# EAGLE design Crystal Cmoy Sch EaglePCB 1 (EAGLE 6.2)
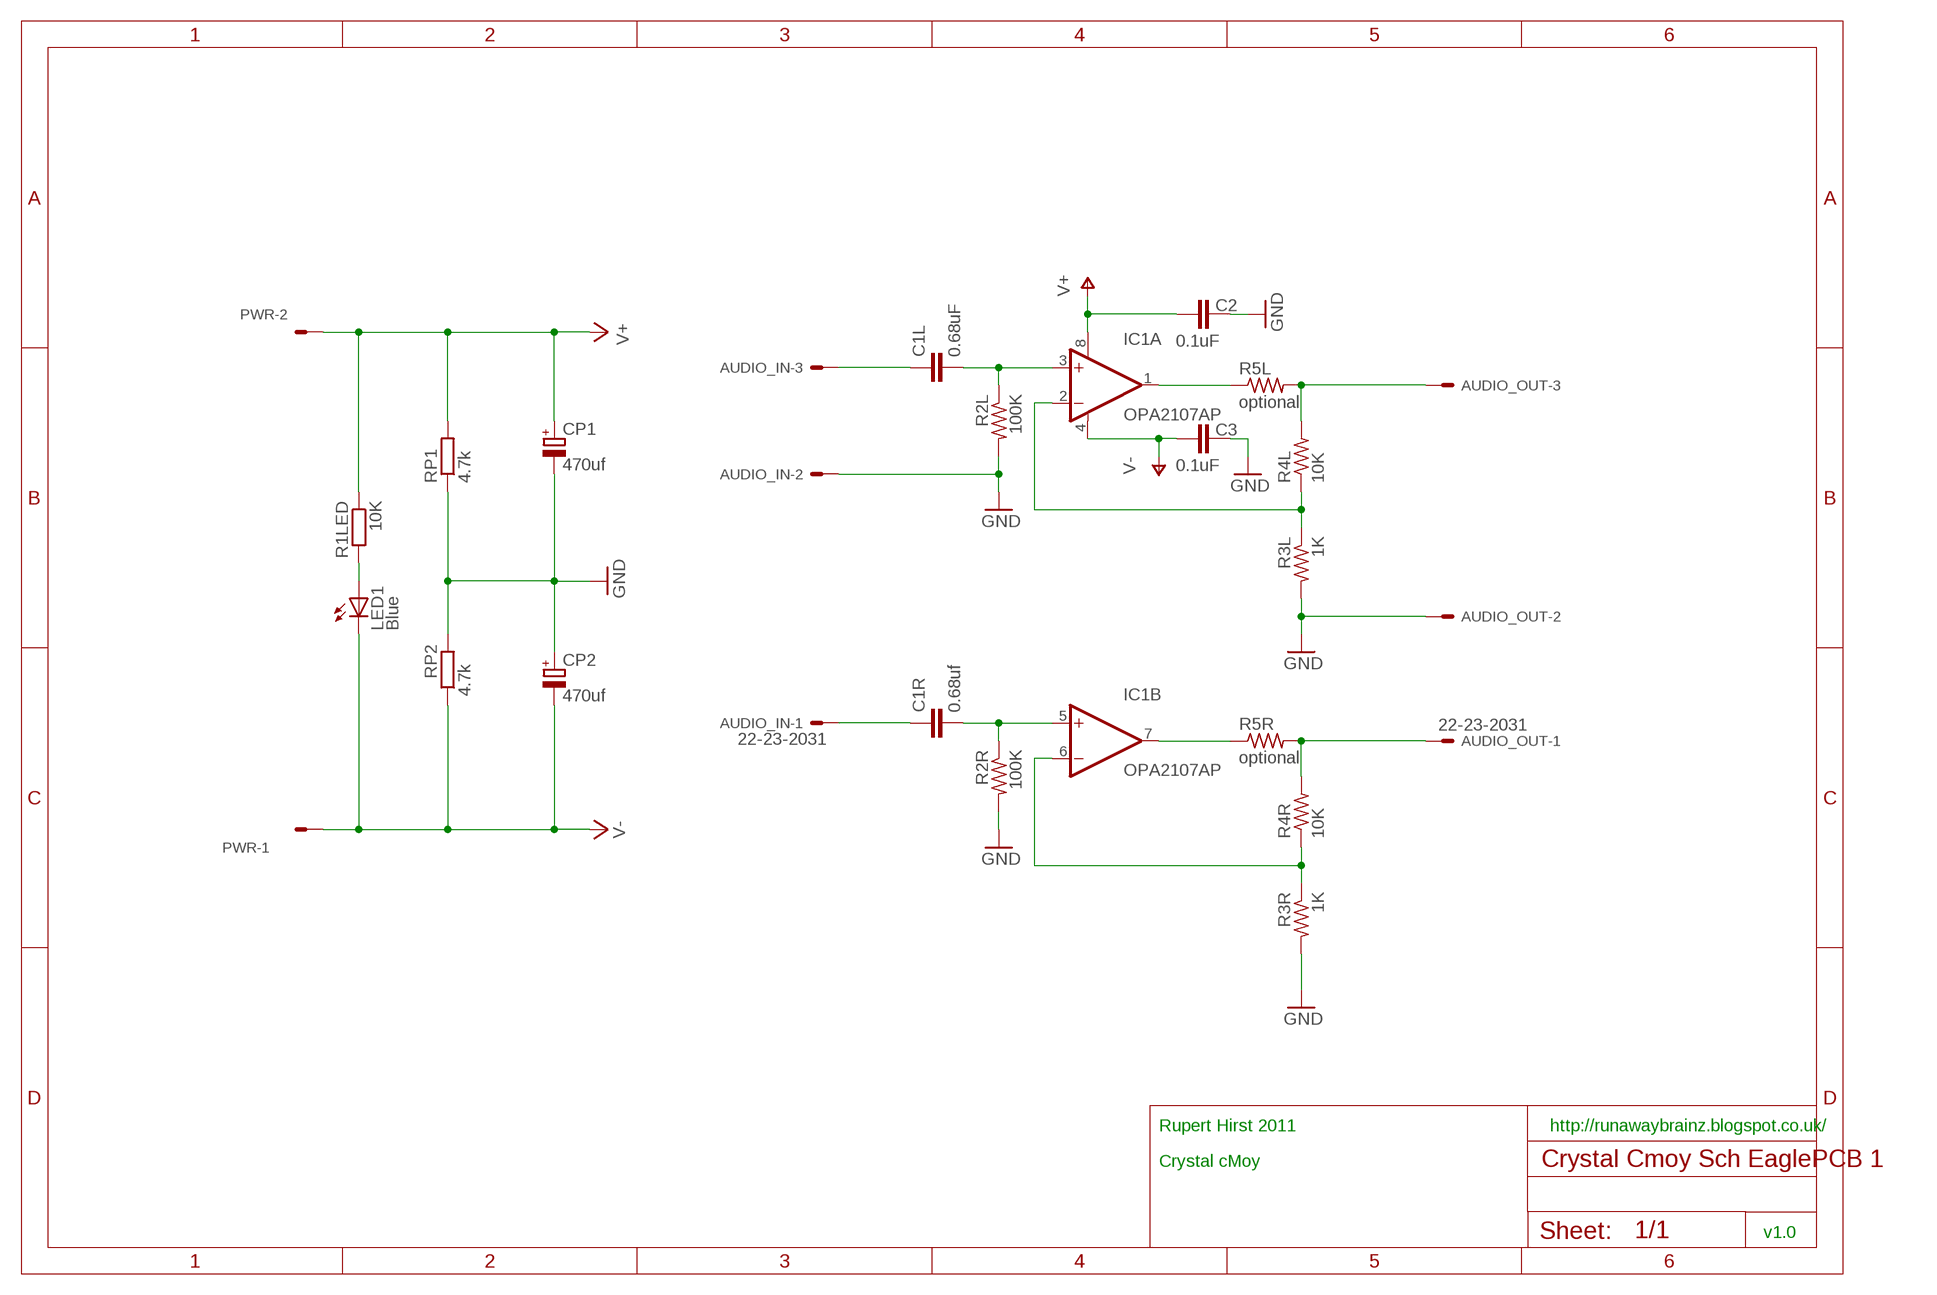
[diagram p0: schematic, sheet 1]

## Parts
AUDIO_IN  22-23-2031  [22-23-2031]
AUDIO_OUT  22-23-2031  [22-23-2031]
C1L  0.68uF  C15/7  [C15B7]
C1R  0.68uf  C15/7  [C15B7]
C2  0.1uF  C5/2.5  [C5B2.5]
C3  0.1uF  C5/5.5  [C5B5.5]
CP1  470uf  CPOL-EUE5-13  [E5-13]
CP2  470uf  CPOL-EUE5-13  [E5-13]
IC1  OPA2107AP  OPA2132P  [DIL08]
LED1  Blue  LED3MM  [LED3MM]
PWR  22-23-2021  [22-23-2021]
R1LED  10K  R-EU_0207/2V  [0207/2V]
R2L  100K  R-US_0207/10  [0207/10]
R2R  100K  R-US_0207/10  [0207/10]
R3L  1K  R-US_0207/10  [0207/10]
R3R  1K  R-US_0207/10  [0207/10]
R4L  10K  R-US_0207/10  [0207/10]
R4R  10K  R-US_0207/10  [0207/10]
R5L  optional  R-US_0207/10  [0207/10]
R5R  optional  R-US_0207/10  [0207/10]
RP1  4.7k  R-EU_0207/10  [0207/10]
RP2  4.7k  R-EU_0207/10  [0207/10]

## Nets
GND: AUDIO_IN.2 AUDIO_OUT.2 C2.1 C3.2 CP1.- CP2.+ R2L.2 R2R.2 R3L.2 R3R.2 RP1.1 RP2.2
L-IN: AUDIO_IN.3 C1L.1
L-OUT: AUDIO_OUT.3 R4L.2 R5L.2
N$1: IC1.1(A:OUT) R5L.1
N$3: IC1.2(A:-IN) R3L.1 R4L.1
N$4: C1L.2 IC1.3(A:+IN) R2L.1
N$5: IC1.7(B:OUT) R5R.1
N$7: IC1.6(B:-IN) R3R.1 R4R.1
N$8: C1R.2 IC1.5(B:+IN) R2R.1
N$14: LED1.A R1LED.2
R-IN: AUDIO_IN.1 C1R.1
R-OUT: AUDIO_OUT.1 R4R.2 R5R.2
V+: C2.2 CP1.+ IC1.8(A:V+) PWR.2 R1LED.1 RP1.2
V-: C3.1 CP2.- IC1.4(A:V-) LED1.K(C) PWR.1 RP2.1

## Notes on the sheet
- Rupert Hirst 2011 | http://runawaybrainz.blogspot.co.uk/
- Crystal cMoy
- v1.0

## Library data of the parts
AUDIO_IN AUDIO_OUT = con-molex:22-23-2031: .100" (2.54mm) Center Header - 3 Pin
C1L C1R C2 C3 = capacitor-wima:C: CAPACITOR naming: grid - package width
CP1 CP2 = rcl:CPOL-EU: POLARIZED CAPACITOR, European symbol
IC1 = burr-brown:OPA2132: High Speed FET-Input Operational Amplifiers< Product Folder:OPA2132
LED1 = led:LED: LED OSRAM: - CHIPLED LG R971, LG N971, LY N971, LG Q971, LY Q971, LO R971, LY R971 LH N974, LH R974 LS Q976, LO Q976, LY Q976 LO Q996 - Hyper CHIPLED LW Q18S LB Q993, LB Q99A, LB R99A - SideLED LS A670, LO A670, LY A670, LG A670, LP A670 LB A673, LV A673, LT A673, LW A673 LH A674 LY A675 LS A676, LA A676, LO A676, LY A676, LW A676 LS A679, LY A679, LG A679 - Hyper Micro SIDELED® LS Y876, LA Y876, LO Y876, LY Y876 LT Y87S - SmartLED LW L88C, LW L88S LB L89C, LB L89S, LG L890 LS L89K, LO L89K, LY L89K LS L896, LA L896, LO L896, LY L896 - TOPLED LS T670, LO T670, LY T670, LG T670, LP T670 LSG T670, LSP T670, LSY T670, LOP T670, LYG T670 LG T671, LOG T671, LSG T671 LB T673, LV T673, LT T673, LW T673 LH T674 LS T676, LA T676, LO T676, LY T676, LB T676, LH T676, LSB T676, LW T676 LB T67C, LV T67C, LT T67C, LS T67K, LO T67K, LY T67K, LW E67C LS E67B, LA E67B, LO E67B, LY E67B, LB E67C, LV E67C, LT E67C LW T67C LS T679, LY T679, LG T679 LS T770, LO T770, LY T770, LG T770, LP T770 LB T773, LV T773, LT T773, LW T773 LH T774 LS E675, LA E675, LY E675, LS T675 LS T776, LA T776, LO T776, LY T776, LB T776 LHGB T686 LT T68C, LB T68C - Hyper Mini TOPLED® LB M676 - Mini TOPLED Santana® LG M470 LS M47K, LO M47K, LY M47K Source: http://www.osram.convergy.de - LUMILED® LXK2-PW12-R00, LXK2-PW12-S00, LXK2-PW14-U00, LXK2-PW14-V00 LXK2-PM12-R00, LXK2-PM12-S00, LXK2-PM14-U00 LXK2-PE12-Q00, LXK2-PE12-R00, LXK2-PE12-S00, LXK2-PE14-T00, LXK2-PE14-U00 LXK2-PB12-K00, LXK2-PB12-L00, LXK2-PB12-M00, LXK2-PB14-N00, LXK2-PB14-P00, LXK2-PB14-Q00 LXK2-PR12-L00, LXK2-PR12-M00, LXK2-PR14-Q00, LXK2-PR14-R00 LXK2-PD12-Q00, LXK2-PD12-R00, LXK2-PD12-S00 LXK2-PH12-R00, LXK2-PH12-S00 LXK2-PL12-P00, LXK2-PL12-Q00, LXK2-PL12-R00 Source: www.luxeon.com
PWR = con-molex:22-23-2021: .100" (2.54mm) Center Header - 2 Pin
R1LED RP1 RP2 = resistor:R-EU_: RESISTOR, European symbol
R2L R2R R3L R3R R4L R4R R5L R5R = rcl:R-US_: RESISTOR, American symbol

## Net classes
0 default: width 1.397 mm, clearance 0.635 mm

## Board
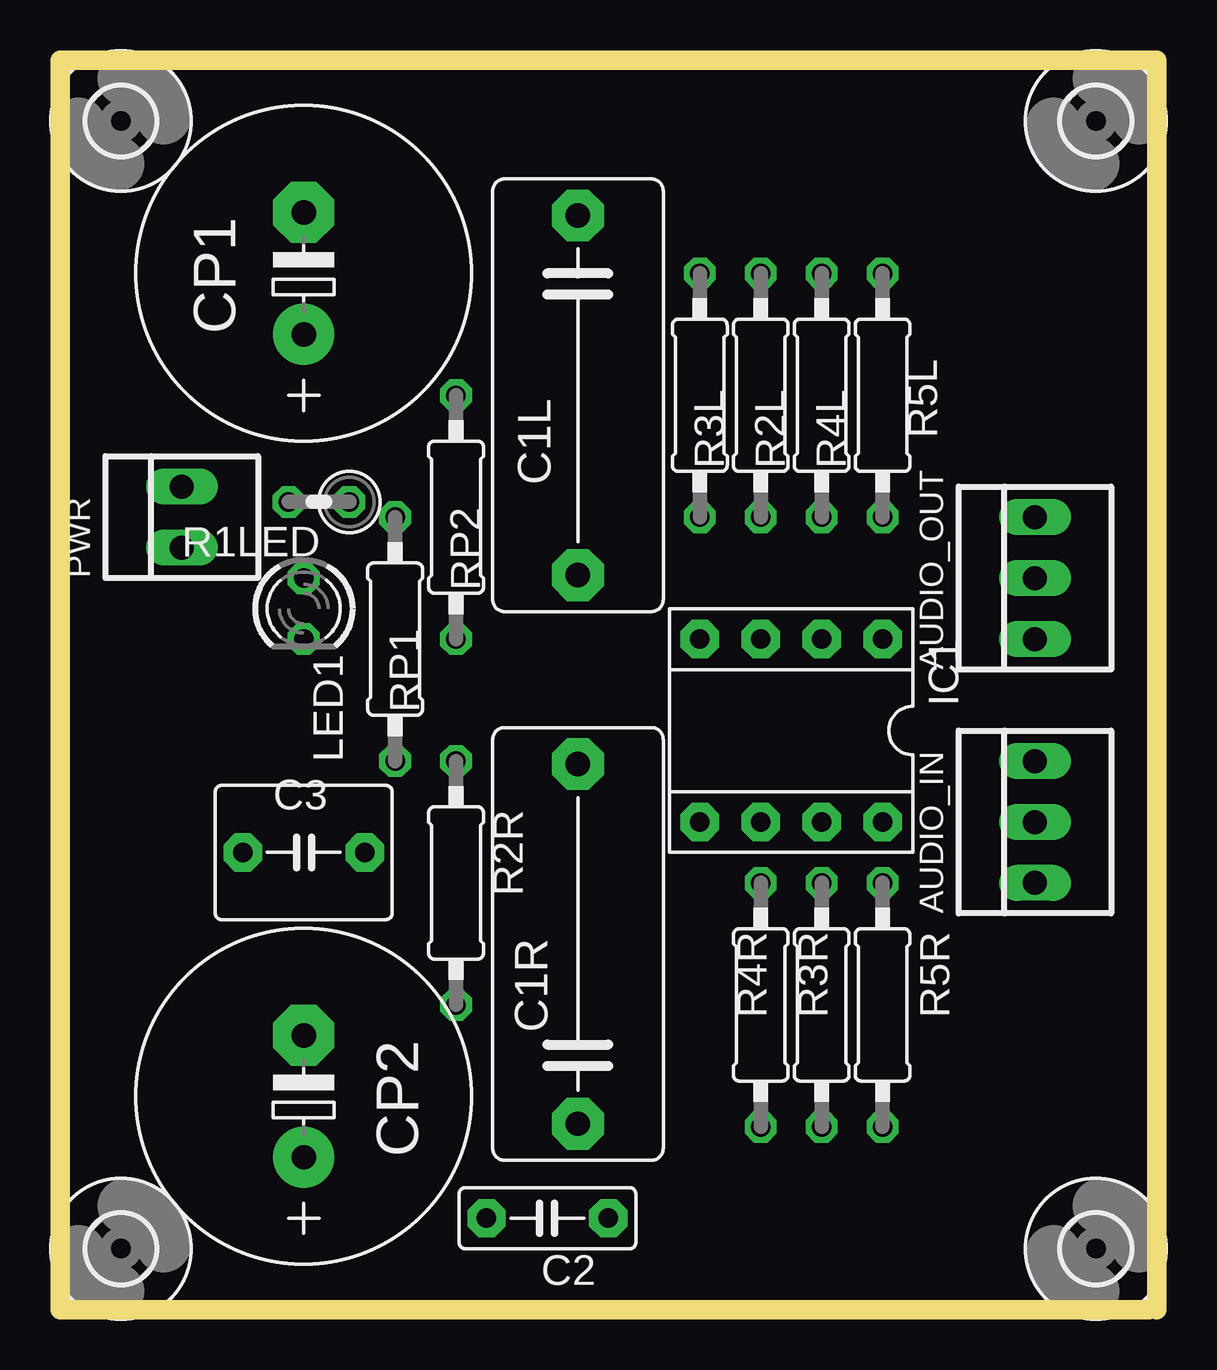
[diagram p1: board, top side]
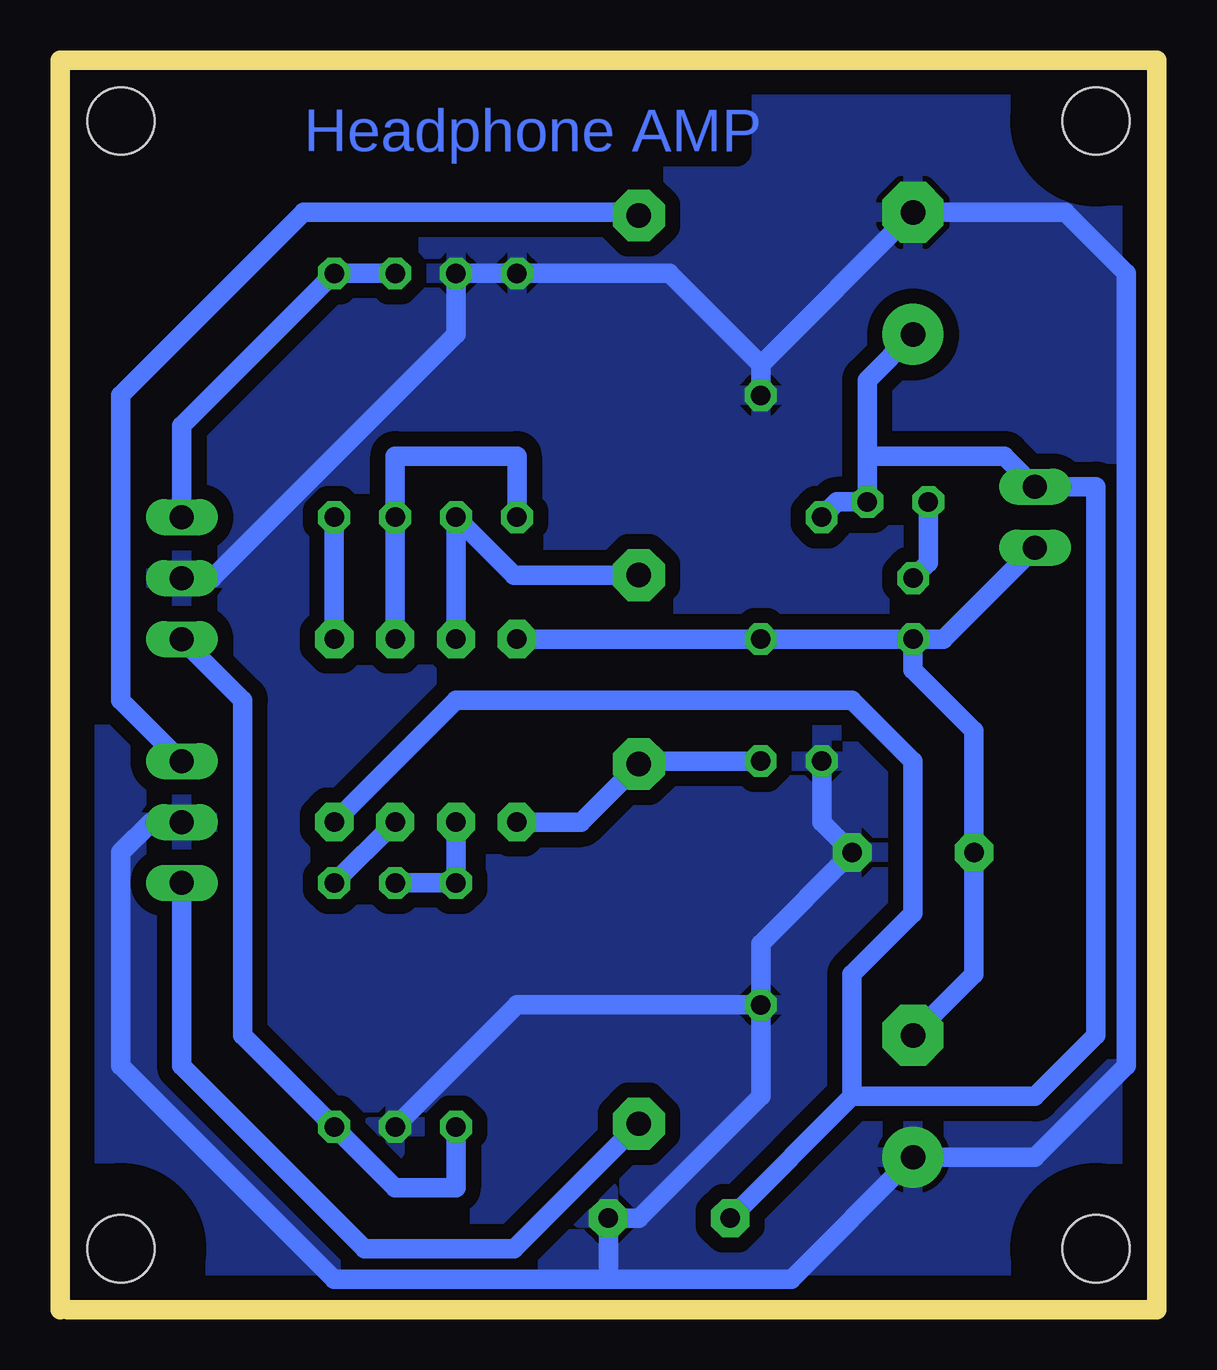
[diagram p2: board, bottom side, seen from below]

Size 45.72 x 52.07 mm. Coordinates in mm from the lower left corner, seen from the top.
Outline: 45.39,0 0,0 0,52.07 45.72,52.07 45.72,0
Copper layers (1*16): Top 0.035mm / dielectric 1.5mm / Bottom 0.035mm
Design rules: minimum track width 10mil, minimum drill 24mil, track to track 8mil, track to pad 8mil, pad to pad 8mil, via to via 8mil, smd to smd 8mil, copper to edge 40mil, drill to drill 8mil, minimum pad ring 10mil, minimum via ring 8mil, stop-mask expansion 4mil, vias tented up to drill 0mil, thermal gap 10mil

### Footprints (pad centres in the part's own frame; a part is rotated, then mirrored left to right if it is on the bottom)
22-23-2031 = drill 1 long: 1 -2.54,0; 2 0,0; 3 2.54,0
C15B7 = drill 1.016 pad 2.159 octagon: 1 -7.493,0; 2 7.493,0
C5B2.5 = drill 0.813 pad 1.6 octagon: 1 -2.54,0; 2 2.54,0
C5B5.5 = drill 0.813 pad 1.6 octagon: 1 -2.54,0; 2 2.54,0
E5-13 = drill 1.016 pad 2.54: + -2.54,0 | drill 1.016 pad 2.54 octagon: - 2.54,0
DIL08 = drill 0.813 pad 1.6 octagon: 1 -3.81,-3.81; 2 -1.27,-3.81; 3 1.27,-3.81; 4 3.81,-3.81; 5 3.81,3.81; 6 1.27,3.81; 7 -1.27,3.81; 8 -3.81,3.81
LED3MM = drill 0.813 octagon: A -1.27,0; K 1.27,0
22-23-2021 = drill 1 long: 1 -1.27,0; 2 1.27,0
0207/2V = drill 0.813 octagon: 1 -1.27,0; 2 1.27,0
0207/10 = drill 0.813 octagon: 1 -5.08,0; 2 5.08,0
2,8 = hole 2.8: 0,0

### Placement (x,y rotation side)
AUDIO_IN  40.64,20.32 90 top
AUDIO_OUT  40.64,30.48 90 top
C1L  21.59,38.1 270 top
C1R  21.59,15.24 90 top
C2  20.32,3.81 180 top
C3  10.16,19.05 0 top
CP1  10.16,43.18 90 top
CP2  10.16,8.89 90 top
IC1  30.48,24.13 180 top
LED1  10.16,29.21 270 top
PWR  5.08,33.02 90 top
R1LED  10.79,33.66 180 top
R2L  29.21,38.1 90 top
R2R  16.51,17.78 270 top
R3L  26.67,38.1 90 top
R3R  31.75,12.7 270 top
R4L  31.75,38.1 90 top
R4R  29.21,12.7 270 top
R5L  34.29,38.1 90 top
R5R  34.29,12.7 270 top
RP1  13.97,27.94 90 top
RP2  16.51,33.02 90 top
U$1  [2,8]  43.18,49.53 0 top
U$2  [2,8]  2.54,49.53 0 top
U$3  [2,8]  2.54,2.54 0 top
U$4  [2,8]  43.18,2.54 0 top

### Tracks (layer width: path | path; a pad name or v marks a point on that pad's centre or on a via)
GND
  Bottom 0.813: RP1.1 13.97,20.32 C3.2 16.51,15.24 R2R.2 | AUDIO_OUT.2 39.37,30.48 29.21,40.64 R2L.2 R3L.2 20.32,43.18 16.51,39.37 | RP2.2 16.51,39.37 | 16.51,39.37 CP1.- 3.81,45.72 1.27,43.18 1.27,10.16 5.08,6.35 CP2.+ 15.24,1.27 22.86,1.27 | 22.86,1.27 C2.1 21.59,3.81 16.51,8.89 R2R.2 | R3R.2 26.67,12.7 R2R.2 | AUDIO_IN.2 41.91,20.32 43.18,19.05 43.18,10.16 34.29,1.27 22.86,1.27
  pour Bottom: 0,0 45.72,0 45.72,52.07 0,52.07
L-IN
  Bottom 0.813: C1L.1 21.46,45.59 21.59,45.72 35.56,45.72 43.18,38.1 43.18,25.4 AUDIO_IN.3
L-OUT
  Bottom 0.813: R4L.2 R5L.2 40.64,36.83 AUDIO_OUT.3
N$1
  Bottom 0.813: R5L.1 IC1.1
N$3
  Bottom 0.813: IC1.2 R4L.1 31.75,35.56 26.67,35.56 R3L.1
N$4
  Bottom 0.813: C1L.2 26.8,30.61 R2L.1 IC1.3
N$5
  Bottom 0.813: R5R.1 IC1.7
N$7
  Bottom 0.813: IC1.6 R4R.1 R3R.1
N$8
  Bottom 0.813: IC1.5 24,20.32 C1R.2 21.46,22.86 R2R.1
N$14
  Bottom 0.813: R1LED.2 9.53,31.11 LED1.A
R-IN
  Bottom 0.813: AUDIO_IN.1 40.64,10.16 33.02,2.54 26.8,2.54 C1R.1
R-OUT
  Bottom 0.813: R4R.2 29.21,5.08 31.75,5.08 R5R.2 38.1,11.43 38.1,25.4 AUDIO_OUT.1
V+
  Bottom 0.813: IC1.8 29.21,25.4 12.7,25.4 10.16,22.86 10.16,16.51 12.7,13.97 12.7,8.89 | C2.2 12.7,8.89 | RP1.2 13.34,33.66 R1LED.1 12.06,35.56 | 12.06,35.56 12.06,38.73 CP1.+ | 12.06,35.56 6.35,35.56 PWR.2 2.54,34.29 2.54,11.43 5.08,8.89 12.7,8.89
V-
  Bottom 0.813: IC1.4 RP2.1 LED1.K | CP2.- 7.62,13.97 C3.1 7.62,24.13 10.16,26.67 LED1.K | PWR.1 8.89,27.94 LED1.K

### Text on the board
Bottom: Headphone AMP